# Altium project imbuelight_stair_controler_ver_1.0.PrjPcb
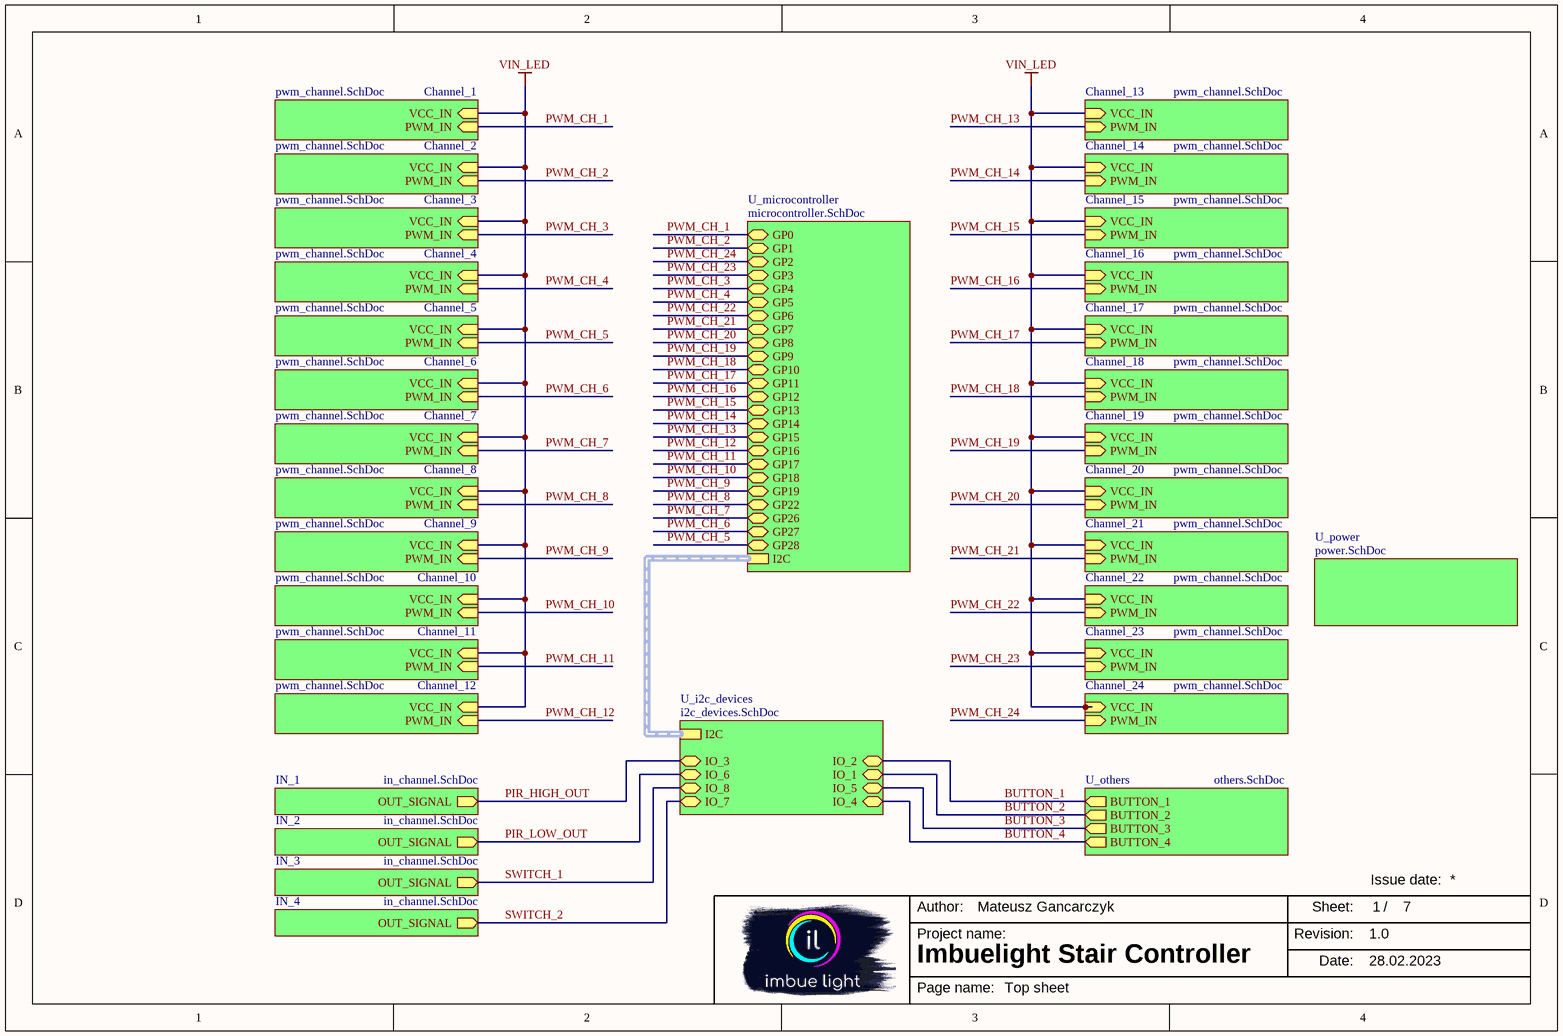
[diagram p0: Top.SchDoc]
My_Author: Mateusz Gancarczyk; My_Date: 28.02.2023; My_NameOfProject: Imbuelight Stair Controller; My_Revision: 1.0
7 sheets, 277 parts. Net scope: hierarchical (ports join the sheet entries above them; power ports are global).
Board file: imbuelight_stair_controller.PcbDoc
Sheets:
  Top.SchDoc
    Channel_1 = pwm_channel.SchDoc
    Channel_2 = pwm_channel.SchDoc
    Channel_3 = pwm_channel.SchDoc
    Channel_4 = pwm_channel.SchDoc
    Channel_5 = pwm_channel.SchDoc
    Channel_6 = pwm_channel.SchDoc
    Channel_7 = pwm_channel.SchDoc
    Channel_8 = pwm_channel.SchDoc
    Channel_9 = pwm_channel.SchDoc
    Channel_10 = pwm_channel.SchDoc
    Channel_11 = pwm_channel.SchDoc
    Channel_12 = pwm_channel.SchDoc
    Channel_13 = pwm_channel.SchDoc
    Channel_14 = pwm_channel.SchDoc
    Channel_15 = pwm_channel.SchDoc
    Channel_16 = pwm_channel.SchDoc
    Channel_17 = pwm_channel.SchDoc
    Channel_18 = pwm_channel.SchDoc
    Channel_19 = pwm_channel.SchDoc
    Channel_20 = pwm_channel.SchDoc
    Channel_21 = pwm_channel.SchDoc
    Channel_22 = pwm_channel.SchDoc
    Channel_23 = pwm_channel.SchDoc
    Channel_24 = pwm_channel.SchDoc
    IN_1 = in_channel.SchDoc
    IN_2 = in_channel.SchDoc
    IN_3 = in_channel.SchDoc
    IN_4 = in_channel.SchDoc
    U_microcontroller = microcontroller.SchDoc
    U_i2c_devices = i2c_devices.SchDoc
    U_power = power.SchDoc
    U_others = others.SchDoc

## Sheet Top.SchDoc
size A4; SheetNumber: 1; SheetTotal: 7; NameOfSheet: Top sheet

### Sub-sheets
Channel_1 = pwm_channel.SchDoc: VCC_IN (in), PWM_IN (in)
Channel_2 = pwm_channel.SchDoc: VCC_IN (in), PWM_IN (in)
Channel_3 = pwm_channel.SchDoc: VCC_IN (in), PWM_IN (in)
Channel_4 = pwm_channel.SchDoc: VCC_IN (in), PWM_IN (in)
Channel_5 = pwm_channel.SchDoc: VCC_IN (in), PWM_IN (in)
Channel_6 = pwm_channel.SchDoc: VCC_IN (in), PWM_IN (in)
Channel_7 = pwm_channel.SchDoc: VCC_IN (in), PWM_IN (in)
Channel_8 = pwm_channel.SchDoc: VCC_IN (in), PWM_IN (in)
Channel_9 = pwm_channel.SchDoc: VCC_IN (in), PWM_IN (in)
Channel_10 = pwm_channel.SchDoc: VCC_IN (in), PWM_IN (in)
Channel_11 = pwm_channel.SchDoc: VCC_IN (in), PWM_IN (in)
Channel_12 = pwm_channel.SchDoc: VCC_IN (in), PWM_IN (in)
Channel_13 = pwm_channel.SchDoc: VCC_IN (in), PWM_IN (in)
Channel_14 = pwm_channel.SchDoc: VCC_IN (in), PWM_IN (in)
Channel_15 = pwm_channel.SchDoc: VCC_IN (in), PWM_IN (in)
Channel_16 = pwm_channel.SchDoc: VCC_IN (in), PWM_IN (in)
Channel_17 = pwm_channel.SchDoc: VCC_IN (in), PWM_IN (in)
Channel_18 = pwm_channel.SchDoc: VCC_IN (in), PWM_IN (in)
Channel_19 = pwm_channel.SchDoc: VCC_IN (in), PWM_IN (in)
Channel_20 = pwm_channel.SchDoc: VCC_IN (in), PWM_IN (in)
Channel_21 = pwm_channel.SchDoc: VCC_IN (in), PWM_IN (in)
Channel_22 = pwm_channel.SchDoc: VCC_IN (in), PWM_IN (in)
Channel_23 = pwm_channel.SchDoc: VCC_IN (in), PWM_IN (in)
Channel_24 = pwm_channel.SchDoc: VCC_IN (in), PWM_IN (in)
IN_1 = in_channel.SchDoc: OUT_SIGNAL (out)
IN_2 = in_channel.SchDoc: OUT_SIGNAL (out)
IN_3 = in_channel.SchDoc: OUT_SIGNAL (out)
IN_4 = in_channel.SchDoc: OUT_SIGNAL (out)
U_i2c_devices = i2c_devices.SchDoc: I2C (harness I2C_SYS2), IO_1 (bidir), IO_2 (bidir), IO_3 (bidir), IO_4 (bidir), IO_5 (bidir), IO_6 (bidir), IO_7 (bidir), IO_8 (bidir)
U_microcontroller = microcontroller.SchDoc: GP0 (bidir), GP1 (bidir), GP2 (bidir), GP3 (bidir), GP4 (bidir), GP5 (bidir), GP6 (bidir), GP7 (bidir), GP8 (bidir), GP9 (bidir), GP10 (bidir), GP11 (bidir), GP12 (bidir), GP13 (bidir), GP14 (bidir), GP15 (bidir), GP16 (bidir), GP17 (bidir), GP18 (bidir), GP19 (bidir), GP22 (bidir), GP26 (bidir), GP27 (bidir), GP28 (bidir), I2C (harness I2C_SYS2)
U_others = others.SchDoc: BUTTON_1 (out), BUTTON_2 (out), BUTTON_3 (out), BUTTON_4 (out)
U_power = power.SchDoc: no entries

### Nets
VIN_LED: sheet Channel_1/VCC_IN, sheet Channel_2/VCC_IN, sheet Channel_3/VCC_IN, sheet Channel_4/VCC_IN, sheet Channel_5/VCC_IN, sheet Channel_6/VCC_IN, sheet Channel_7/VCC_IN, sheet Channel_8/VCC_IN, sheet Channel_9/VCC_IN, sheet Channel_10/VCC_IN, sheet Channel_11/VCC_IN, sheet Channel_12/VCC_IN, sheet Channel_13/VCC_IN, sheet Channel_14/VCC_IN, sheet Channel_15/VCC_IN, sheet Channel_16/VCC_IN, sheet Channel_17/VCC_IN, sheet Channel_18/VCC_IN, sheet Channel_19/VCC_IN, sheet Channel_20/VCC_IN, sheet Channel_21/VCC_IN, sheet Channel_22/VCC_IN, sheet Channel_23/VCC_IN, sheet Channel_24/VCC_IN
BUTTON_1: sheet U_i2c_devices/IO_2, sheet U_others/BUTTON_1
BUTTON_2: sheet U_i2c_devices/IO_1, sheet U_others/BUTTON_2
BUTTON_3: sheet U_i2c_devices/IO_5, sheet U_others/BUTTON_3
BUTTON_4: sheet U_i2c_devices/IO_4, sheet U_others/BUTTON_4
PIR_HIGH_OUT: sheet IN_1/OUT_SIGNAL, sheet U_i2c_devices/IO_3
PIR_LOW_OUT: sheet IN_2/OUT_SIGNAL, sheet U_i2c_devices/IO_6
PWM_CH_1: sheet Channel_1/PWM_IN, sheet U_microcontroller/GP0  [project net GP0]
PWM_CH_2: sheet Channel_2/PWM_IN, sheet U_microcontroller/GP1  [project net GP1]
PWM_CH_3: sheet Channel_3/PWM_IN, sheet U_microcontroller/GP4  [project net GP4]
PWM_CH_4: sheet Channel_4/PWM_IN, sheet U_microcontroller/GP5  [project net GP5]
PWM_CH_5: sheet Channel_5/PWM_IN, sheet U_microcontroller/GP28  [project net GP28]
PWM_CH_6: sheet Channel_6/PWM_IN, sheet U_microcontroller/GP27  [project net GP27]
PWM_CH_7: sheet Channel_7/PWM_IN, sheet U_microcontroller/GP26  [project net GP26]
PWM_CH_8: sheet Channel_8/PWM_IN, sheet U_microcontroller/GP22  [project net GP22]
PWM_CH_9: sheet Channel_9/PWM_IN, sheet U_microcontroller/GP19  [project net GP19]
PWM_CH_10: sheet Channel_10/PWM_IN, sheet U_microcontroller/GP18  [project net GP18]
PWM_CH_11: sheet Channel_11/PWM_IN, sheet U_microcontroller/GP17  [project net GP17]
PWM_CH_12: sheet Channel_12/PWM_IN, sheet U_microcontroller/GP16  [project net GP16]
PWM_CH_13: sheet Channel_13/PWM_IN, sheet U_microcontroller/GP15  [project net GP15]
PWM_CH_14: sheet Channel_14/PWM_IN, sheet U_microcontroller/GP14  [project net GP14]
PWM_CH_15: sheet Channel_15/PWM_IN, sheet U_microcontroller/GP13  [project net GP13]
PWM_CH_16: sheet Channel_16/PWM_IN, sheet U_microcontroller/GP12  [project net GP12]
PWM_CH_17: sheet Channel_17/PWM_IN, sheet U_microcontroller/GP11  [project net GP11]
PWM_CH_18: sheet Channel_18/PWM_IN, sheet U_microcontroller/GP10  [project net GP10]
PWM_CH_19: sheet Channel_19/PWM_IN, sheet U_microcontroller/GP9  [project net GP9]
PWM_CH_20: sheet Channel_20/PWM_IN, sheet U_microcontroller/GP8  [project net GP8]
PWM_CH_21: sheet Channel_21/PWM_IN, sheet U_microcontroller/GP7  [project net GP7]
PWM_CH_22: sheet Channel_22/PWM_IN, sheet U_microcontroller/GP6  [project net GP6]
PWM_CH_23: sheet Channel_23/PWM_IN, sheet U_microcontroller/GP3  [project net GP3]
PWM_CH_24: sheet Channel_24/PWM_IN, sheet U_microcontroller/GP2  [project net GP2]
SWITCH_1: sheet IN_3/OUT_SIGNAL, sheet U_i2c_devices/IO_8
SWITCH_2: sheet IN_4/OUT_SIGNAL, sheet U_i2c_devices/IO_7

### Buses and harness runs
harness sheet U_i2c_devices/I2C = sheet U_microcontroller/I2C

### Notes on the sheet
- Author:
- Sheet:
- /
- Issue date:
- Project name:
- Revision:
- Date:
- Page name:

## Sheet pwm_channel.SchDoc
size A4; SheetNumber: 2; SheetTotal: 7; NameOfSheet: PWM channels
Used 24 times, as channels Channel_1, Channel_2, Channel_3, Channel_4, Channel_5, Channel_6, Channel_7, Channel_8, Channel_9, Channel_10, Channel_11, Channel_12, Channel_13, Channel_14, Channel_15, Channel_16, Channel_17, Channel_18, Channel_19, Channel_20, Channel_21, Channel_22, Channel_23, Channel_24. Parts and nets are listed once, with the designators drawn on the sheet.
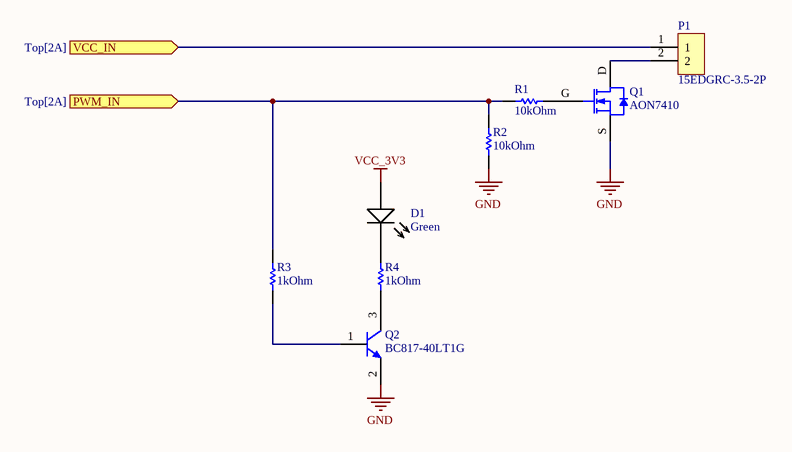
[diagram p1: pwm_channel.SchDoc]

### Parts
D1  Colour: Green  [LED_0603]  (hidden comment: C205450)
P1  15EDGRC-3.5-2P  [15EDGRC-3.5 - 2 pin]
Q1  AON7410  [DFN3x3_8L]
Q2  BC817-40LT1G  [SOT-23A]
R1  Resistance: 10kOhm  [RES_0603]  (hidden comment: 0603 10kOhm 1%)
R2  Resistance: 10kOhm  [RES_0603]  (hidden comment: 0603 10kOhm 1%)
R3  Resistance: 1kOhm  [RES_0603]  (hidden comment: 0603 1kOhm 1%)
R4  Resistance: 1kOhm  [RES_0603]  (hidden comment: 0603 1kOhm 1%)

### Ports
PWM_IN (in, see Top[2A]), VCC_IN (in, see Top[2A])

### Nets
GND: Q1.S Q2.2(E) R2.2
VCC_3V3: D1.A
PWM_IN: R1.2 R2.1 R3.2 ; port PWM_IN
VCC_IN: P1.1 ; port VCC_IN
NetD1_C: D1.C R4.2
NetP1_2: P1.2 Q1.D
NetQ1_G: Q1.G R1.1
NetQ2_1: Q2.1 R3.1
NetQ2_3: Q2.3(C) R4.1

### Channels
Channel_1: designators end in _Channel_1; ports PWM_IN=GP0 VCC_IN=VIN_LED
Channel_2: designators end in _Channel_2; ports PWM_IN=GP1 VCC_IN=VIN_LED
Channel_3: designators end in _Channel_3; ports PWM_IN=GP4 VCC_IN=VIN_LED
Channel_4: designators end in _Channel_4; ports PWM_IN=GP5 VCC_IN=VIN_LED
Channel_5: designators end in _Channel_5; ports PWM_IN=GP28 VCC_IN=VIN_LED
Channel_6: designators end in _Channel_6; ports PWM_IN=GP27 VCC_IN=VIN_LED
Channel_7: designators end in _Channel_7; ports PWM_IN=GP26 VCC_IN=VIN_LED
Channel_8: designators end in _Channel_8; ports PWM_IN=GP22 VCC_IN=VIN_LED
Channel_9: designators end in _Channel_9; ports PWM_IN=GP19 VCC_IN=VIN_LED
Channel_10: designators end in _Channel_10; ports PWM_IN=GP18 VCC_IN=VIN_LED
Channel_11: designators end in _Channel_11; ports PWM_IN=GP17 VCC_IN=VIN_LED
Channel_12: designators end in _Channel_12; ports PWM_IN=GP16 VCC_IN=VIN_LED
Channel_13: designators end in _Channel_13; ports PWM_IN=GP15 VCC_IN=VIN_LED
Channel_14: designators end in _Channel_14; ports PWM_IN=GP14 VCC_IN=VIN_LED
Channel_15: designators end in _Channel_15; ports PWM_IN=GP13 VCC_IN=VIN_LED
Channel_16: designators end in _Channel_16; ports PWM_IN=GP12 VCC_IN=VIN_LED
Channel_17: designators end in _Channel_17; ports PWM_IN=GP11 VCC_IN=VIN_LED
Channel_18: designators end in _Channel_18; ports PWM_IN=GP10 VCC_IN=VIN_LED
Channel_19: designators end in _Channel_19; ports PWM_IN=GP9 VCC_IN=VIN_LED
Channel_20: designators end in _Channel_20; ports PWM_IN=GP8 VCC_IN=VIN_LED
Channel_21: designators end in _Channel_21; ports PWM_IN=GP7 VCC_IN=VIN_LED
Channel_22: designators end in _Channel_22; ports PWM_IN=GP6 VCC_IN=VIN_LED
Channel_23: designators end in _Channel_23; ports PWM_IN=GP3 VCC_IN=VIN_LED
Channel_24: designators end in _Channel_24; ports PWM_IN=GP2 VCC_IN=VIN_LED

### Notes on the sheet
- Author:
- Sheet:
- /
- Issue date:
- Project name:
- Revision:
- Date:
- Page name:

### Library data of the parts
D1 = LED diode: Generic LED diode SMD Green; Forward current: 0mA; Forward Voltage: 0V; Manufacturer Part Number: C205450; Supplier 1: LCSC; Supplier Part Number 1: C205450
P1 = 15EDGRC-3.5-2P: 15EDGRC-3.5 - 2 pin; Manufacturer Part Number: 15EDGRC-3.5-2P; Supplier 1: LCSC; Supplier Part Number 1: C61791
Q1 = AON7410: Tranzystor MOSFET kanał N; Supplier 1: LCSC; Supplier Part Number 1: C269266
Q2 = BC817-40LT1G: General Purpose Transistor, NPN Silicon, 3-Pin SOT-23, Pb-Free, Tape and Reel; Manufacturer: On Semiconductor; fT Min (MHz): 100; IC Continuous (A): 0.5; ComponentLink2URL: http://www.onsemi.com/pub_link/Collateral/BC817-16LT1-D.PDF; DatasheetVersion: Rev. 12; ComponentLink3URL: http://www.onsemi.cn/pub_link/Collateral/318-08.PDF; ComponentLink3Description: Package Specification; ComponentLink1Description: Manufacturer URL; Mounting Technology: Surface Mount; ComponentLink1URL: http://www.onsemi.com/; Packing: Tape and Reel; ComponentLink2Description: Datasheet; Polarity: NPN; RoHS: TRUE; PackageVersion: Rev. AP, 11/2009; PartNumber: BC817-40LT1G; PackageDescription: 3-Pin Small Outline Transistor, Body 2.92 x 1.3 mm, Pitch 0.95 mm; PackageReference: SOT-23-3-318-08; Supplier 1: LCSC; Supplier Part Number 1: C94412
R1-R4 = Resistor SMD_1: Generic Resistor SMD; Supplier 1: LCSC
  R1 R2: Manufacturer Part Number: 0603 10kOhm 1%; Supplier Part Number 1: C3017715
  R3 R4: Manufacturer Part Number: 0603 1kOhm 1%; Supplier Part Number 1: C3016283

## Sheet in_channel.SchDoc
size A4; SheetNumber: 7; SheetTotal: 7; NameOfSheet: PWM channels
Used 4 times, as channels IN_1, IN_2, IN_3, IN_4. Parts and nets are listed once, with the designators drawn on the sheet.
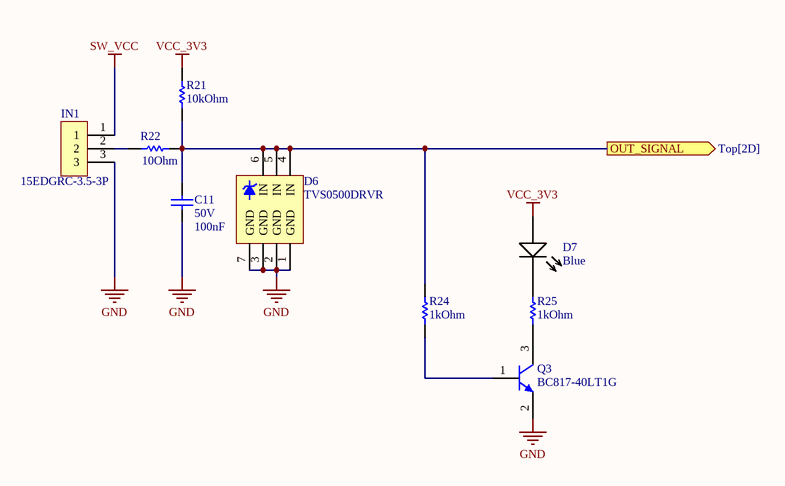
[diagram p2: in_channel.SchDoc]

### Parts
C11  Voltage: 50V  Capacitance: 100nF  [CAP_0603_High_density]
D6  TVS0500DRVR  [FP-DRV0006A-IPC_C]
D7  Colour: Blue  [LED_0603]  (hidden comment: C84266)
IN1  15EDGRC-3.5-3P  [15EDGRC-3.5 - 3 PIN]
Q3  BC817-40LT1G  [SOT-23A]
R21  Resistance: 10kOhm  [RES_0603]  (hidden comment: 0603 10kOhm 1%)
R22  Resistance: 10Ohm  [RES_0603]  (hidden comment: 0603 10Ohm 1%)
R24  Resistance: 1kOhm  [RES_0603]  (hidden comment: 0603 1kOhm 1%)
R25  Resistance: 1kOhm  [RES_0603]  (hidden comment: 0603 1kOhm 1%)

### Ports
OUT_SIGNAL (out, see Top[2D])

### Nets
GND: C11.2 D6.1(GND) D6.2(GND) D6.3(GND) D6.7(GND) IN1.3 Q3.2(E)
SW_VCC: IN1.1
VCC_3V3: D7.A R21.1
OUT_SIGNAL: C11.1 D6.4(IN) D6.5(IN) D6.6(IN) R21.2 R22.2 R24.2 ; port OUT_SIGNAL
NetD7_C: D7.C R25.2
NetIN1_2: IN1.2 R22.1
NetQ3_1: Q3.1 R24.1
NetQ3_3: Q3.3(C) R25.1

### Channels
IN_1: designators end in _IN_1; ports OUT_SIGNAL=PIR_HIGH_OUT
IN_2: designators end in _IN_2; ports OUT_SIGNAL=PIR_LOW_OUT
IN_3: designators end in _IN_3; ports OUT_SIGNAL=SWITCH_1
IN_4: designators end in _IN_4; ports OUT_SIGNAL=SWITCH_2

### Notes on the sheet
- Author:
- Sheet:
- /
- Issue date:
- Project name:
- Revision:
- Date:
- Page name:

### Library data of the parts
C11 = Capacitor SMD: Generic Ceramic Capacitor SMD; Temperature Coefficient: X7R; Tolerance: 10%; Package: 0603; Supplier 1: LCSC; Supplier Part Number 1: C282519
D6 = TVS0500DRVR: ESD Suppressors / TVS Diodes 5V flat-clamp surge protection device 6-WSON -40 to 125; Supplier 1: Digi-Key; Supplier Part Number 1: 296-48382-1-ND
D7 = LED diode: Generic LED diode SMD Blue; Forward current: 0mA; Forward Voltage: 0V; Manufacturer Part Number: C84266; Supplier 1: LCSC; Supplier Part Number 1: C84266
IN1 = 15EDGRC-3.5-3P: 15EDGRC-3.5 - 3 pin; Manufacturer Part Number: 15EDGRC-3.5-3P; Supplier 1: LCSC; Supplier Part Number 1: C880573
Q3 = BC817-40LT1G: as Q2 on sheet pwm_channel; ComponentLink2URL: http://www.onsemi.com/pub_link/Collateral/BC817-16LT1-D.PDF; DatasheetVersion: Rev. 12; ComponentLink3URL: http://www.onsemi.cn/pub_link/Collateral/318-08.PDF; ComponentLink3Description: Package Specification; ComponentLink1Description: Manufacturer URL; Mounting Technology: Surface Mount; ComponentLink1URL: http://www.onsemi.com/; Packing: Tape and Reel; ComponentLink2Description: Datasheet; Polarity: NPN; RoHS: TRUE; PackageVersion: Rev. AP, 11/2009; PartNumber: BC817-40LT1G; PackageDescription: 3-Pin Small Outline Transistor, Body 2.92 x 1.3 mm, Pitch 0.95 mm; PackageReference: SOT-23-3-318-08; Supplier 1: LCSC; Supplier Part Number 1: C94412
R21 R22 R24 R25 = Resistor SMD_1: Generic Resistor SMD; Supplier 1: LCSC
  R21: Manufacturer Part Number: 0603 10kOhm 1%; Supplier Part Number 1: C3017715
  R22: Manufacturer Part Number: 0603 10Ohm 1%; Supplier Part Number 1: C22859
  R24 R25: Manufacturer Part Number: 0603 1kOhm 1%; Supplier Part Number 1: C3016283

## Sheet microcontroller.SchDoc
size A4; SheetNumber: 3; SheetTotal: 7; NameOfSheet: Microcontroller
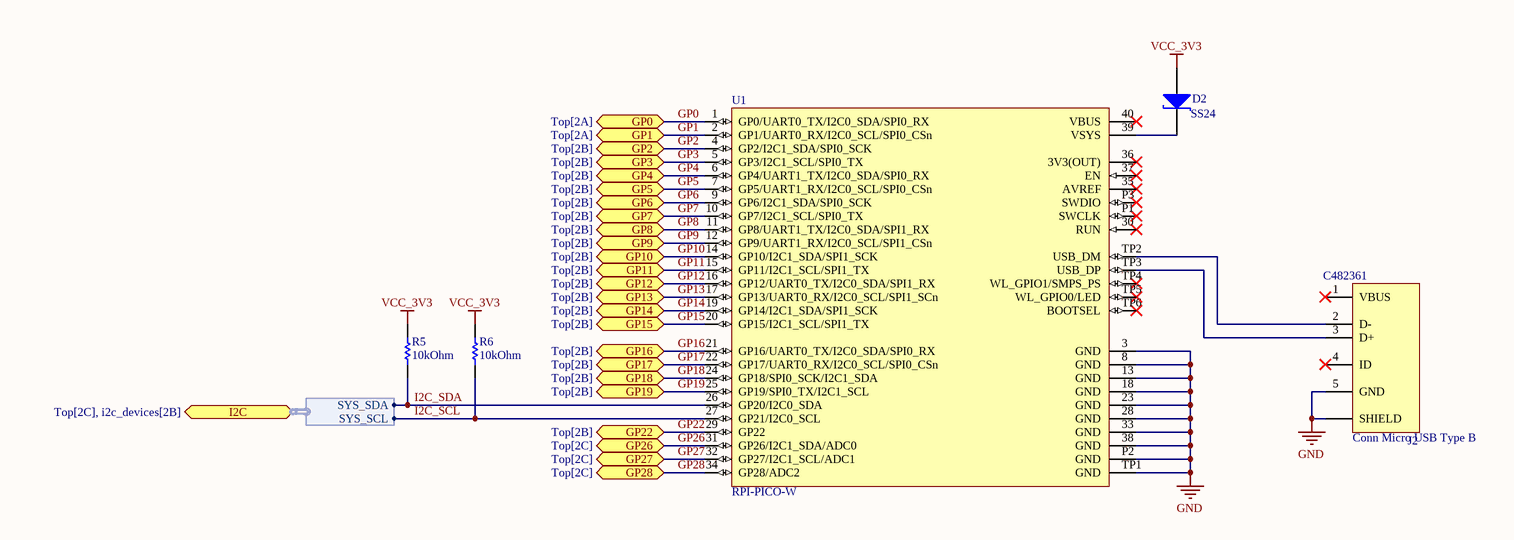
[diagram p3: microcontroller.SchDoc]

### Parts
D2  SS24  [DO214AA]
J2  Name: Conn Micro USB Type B  Supplier Part Number 1: C482361  [10118193-0001LF]  (hidden comment: 10118193-0001LF)
R5  Resistance: 10kOhm  [RES_0603]  (hidden comment: 0603 10kOhm 1%)
R6  Resistance: 10kOhm  [RES_0603]  (hidden comment: 0603 10kOhm 1%)
U1  RPI-PICO-W  [RPI-PICO-W]

### Ports
GP0 (bidir, see Top[2A]), GP1 (bidir, see Top[2A]), GP2 (bidir, see Top[2B]), GP3 (bidir, see Top[2B]), GP4 (bidir, see Top[2B]), GP5 (bidir, see Top[2B]), GP6 (bidir, see Top[2B]), GP7 (bidir, see Top[2B]), GP8 (bidir, see Top[2B]), GP9 (bidir, see Top[2B]), GP10 (bidir, see Top[2B]), GP11 (bidir, see Top[2B]), GP12 (bidir, see Top[2B]), GP13 (bidir, see Top[2B]), GP14 (bidir, see Top[2B]), GP15 (bidir, see Top[2B]), GP16 (bidir, see Top[2B]), GP17 (bidir, see Top[2B]), GP18 (bidir, see Top[2B]), GP19 (bidir, see Top[2B]), GP22 (bidir, see Top[2B]), GP26 (bidir, see Top[2C]), GP27 (bidir, see Top[2C]), GP28 (bidir, see Top[2C]), I2C (bidir, harness I2C_SYS2, see Top[2C], i2c_devices[2B])

### Harnesses
I2C_SYS2: SYS_SCL, SYS_SDA

### Nets
GND: J2.5(GND) J2.S1(SHIELD) U1.3(GND) U1.8(GND) U1.13(GND) U1.18(GND) U1.23(GND) U1.28(GND) U1.33(GND) U1.38(GND) U1.P2(GND) U1.TP1(GND)
VCC_3V3: D2.A R5.1 R6.1
GP0: U1.1(GP0/UART0_TX/I2C0_SDA/SPI0_RX) ; port GP0
GP1: U1.2(GP1/UART0_RX/I2C0_SCL/SPI0_CSn) ; port GP1
GP2: U1.4(GP2/I2C1_SDA/SPI0_SCK) ; port GP2
GP3: U1.5(GP3/I2C1_SCL/SPI0_TX) ; port GP3
GP4: U1.6(GP4/UART1_TX/I2C0_SDA/SPI0_RX) ; port GP4
GP5: U1.7(GP5/UART1_RX/I2C0_SCL/SPI0_CSn) ; port GP5
GP6: U1.9(GP6/I2C1_SDA/SPI0_SCK) ; port GP6
GP7: U1.10(GP7/I2C1_SCL/SPI0_TX) ; port GP7
GP8: U1.11(GP8/UART1_TX/I2C0_SDA/SPI1_RX) ; port GP8
GP9: U1.12(GP9/UART1_RX/I2C0_SCL/SPI1_CSn) ; port GP9
GP10: U1.14(GP10/I2C1_SDA/SPI1_SCK) ; port GP10
GP11: U1.15(GP11/I2C1_SCL/SPI1_TX) ; port GP11
GP12: U1.16(GP12/UART0_TX/I2C0_SDA/SPI1_RX) ; port GP12
GP13: U1.17(GP13/UART0_RX/I2C0_SCL/SPI1_SCn) ; port GP13
GP14: U1.19(GP14/I2C1_SDA/SPI1_SCK) ; port GP14
GP15: U1.20(GP15/I2C1_SCL/SPI1_TX) ; port GP15
GP16: U1.21(GP16/UART0_TX/I2C0_SDA/SPI0_RX) ; port GP16
GP17: U1.22(GP17/UART0_RX/I2C0_SCL/SPI0_CSn) ; port GP17
GP18: U1.24(GP18/SPI0_SCK/I2C1_SDA) ; port GP18
GP19: U1.25(GP19/SPI0_TX/I2C1_SCL) ; port GP19
GP22: U1.29(GP22) ; port GP22
GP26: U1.31(GP26/I2C1_SDA/ADC0) ; port GP26
GP27: U1.32(GP27/I2C1_SCL/ADC1) ; port GP27
GP28: U1.34(GP28/ADC2) ; port GP28
I2C_SCL: R6.2 U1.27(GP21/I2C0_SCL) ; port I2C.SYS_SCL
I2C_SDA: R5.2 U1.26(GP20/I2C0_SDA) ; port I2C.SYS_SDA
NetD2_K: D2.K U1.39(VSYS)
NetJ2_2: J2.2(D-) U1.TP2(USB_DM)
NetJ2_3: J2.3(D+) U1.TP3(USB_DP)

Not connected (* = marked no-connect by the designer): J2 1(VBUS)* 4(ID)*; U1 30(RUN)* 35(AVREF)* 36(3V3(OUT))* 37(EN)* 40(VBUS)* P1(SWCLK)* P3(SWDIO)* TP4(WL_GPIO1/SMPS_PS)* TP5(WL_GPIO0/LED)* TP6(BOOTSEL)*

### Notes on the sheet
- Author:
- Sheet:
- /
- Issue date:
- Project name:
- Revision:
- Date:
- Page name:

### Library data of the parts
D2 = Dioda prostownicza Schottky: 40V Single 500mV@2A 2A DO-214AA Schottky Barrier Diodes (SBD) ROHS; Typ obudowy: SMA; Opis: Dioda prostownicza Schottky; Wartość: SS24; Supplier 1: LCSC; Supplier Part Number 1: C2845097
J2 = 10118193-0001LF: Conn Micro USB Type B RCP 5 POS 0.65mm Solder RA SMD 5 Terminal 1 Port T/R; Supplier 1: LCSC
R5 R6 = Resistor SMD_1: Generic Resistor SMD; Manufacturer Part Number: 0603 10kOhm 1%; Supplier 1: LCSC; Supplier Part Number 1: C3017715
U1 = RPI-PICO-W: Raspberry Pi Pico W - RP2040 ARM Cortex M0+ CYW43439; Manufacturer: Raspberry Pi Foundation; Manufacturer Part No: SC0915; Mounting Technology: SMT; Supplier: DigiKey; Supplier Part No: 2648-SC0915CT-ND; Supplier Link: https://www.digikey.com/en/products/detail/raspberry-pi/SC0915/13684020

## Sheet i2c_devices.SchDoc
size A4; SheetNumber: 4; SheetTotal: 7; NameOfSheet: OLED display
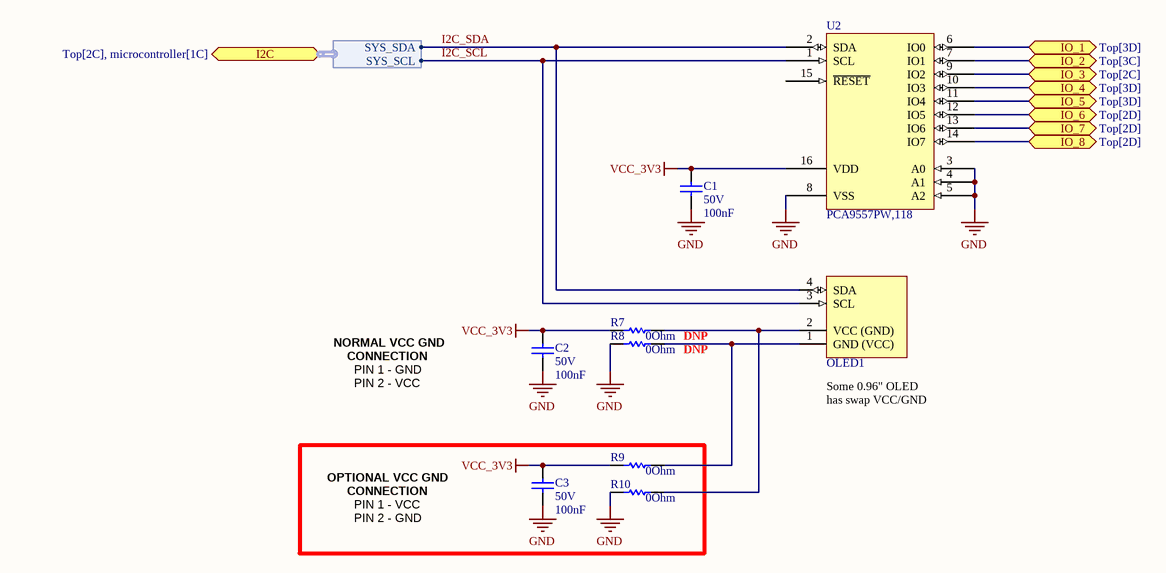
[diagram p4: i2c_devices.SchDoc]

### Parts
C1  Voltage: 50V  Capacitance: 100nF  [CAP_0603_High_density]
C2  Voltage: 50V  Capacitance: 100nF  [CAP_0603_High_density]
C3  Voltage: 50V  Capacitance: 100nF  [CAP_0603_High_density]
OLED1  MDOB128064WV-YBI  [OLED_I2C]  (value not drawn)
R7  Resistance: 0Ohm  [RES_0603]  (hidden comment: RES_0_0402_1_1/16)  (no BOM)
R8  Resistance: 0Ohm  [RES_0603]  (hidden comment: RES_0_0402_1_1/16)  (no BOM)
R9  Resistance: 0Ohm  [RES_0603]  (hidden comment: RES_0_0402_1_1/16)
R10  Resistance: 0Ohm  [RES_0603]  (hidden comment: RES_0_0402_1_1/16)
U2  PCA9557PW,118  [TSOP65P640X120-16M]

### Ports
I2C (bidir, harness I2C_SYS2, see Top[2C], microcontroller[1C]), IO_1 (bidir, see Top[3D]), IO_2 (bidir, see Top[3C]), IO_3 (bidir, see Top[2C]), IO_4 (bidir, see Top[3D]), IO_5 (bidir, see Top[3D]), IO_6 (bidir, see Top[2D]), IO_7 (bidir, see Top[2D]), IO_8 (bidir, see Top[2D])

### Harnesses
I2C_SYS2: SYS_SCL, SYS_SDA

### Nets
GND: C1.2 C2.2 C3.2 R8.2 R10.2 U2.3(A0) U2.4(A1) U2.5(A2) U2.8(VSS)
VCC_3V3: C1.1 C2.1 C3.1 R7.2 R9.2 U2.16(VDD)
BUTTON_1: U2.7(IO1) ; port IO_2
BUTTON_2: U2.6(IO0) ; port IO_1
BUTTON_3: U2.11(IO4) ; port IO_5
BUTTON_4: U2.10(IO3) ; port IO_4
I2C_SCL: OLED1.3(SCL) U2.1(SCL) ; port I2C.SYS_SCL
I2C_SDA: OLED1.4(SDA) U2.2(SDA) ; port I2C.SYS_SDA
PIR_HIGH_OUT: U2.9(IO2) ; port IO_3
PIR_LOW_OUT: U2.12(IO5) ; port IO_6
SWITCH_1: U2.14(IO7) ; port IO_8
SWITCH_2: U2.13(IO6) ; port IO_7
NetOLED1_1: OLED1.1(GND_(VCC)) R8.1 R9.1
NetOLED1_2: OLED1.2(VCC_(GND)) R7.1 R10.1

Not connected (* = marked no-connect by the designer): U2 15(~{RESET})

### Notes on the sheet
- NORMAL VCC GND
- CONNECTION
- DNP
- PIN 1 - GND
- PIN 2 - VCC
- (near OLED1) Some 0.96" OLED has swap VCC/GND
- OPTIONAL VCC GND
- PIN 1 - VCC
- PIN 2 - GND
- Author:
- Sheet:
- /
- Issue date:
- Project name:
- Revision:
- Date:
- Page name:

### Library data of the parts
C1-C3 = Capacitor SMD: as C11 on sheet in_channel; Package: 0603; Supplier 1: LCSC; Supplier Part Number 1: C282519
OLED1 = OLED_I2C: Graphic OLED, 128 x 64 Pixels, Yellow on Black, 3.3V, I2C, 27.30mm x 27.30mm x 2.72mm panel size; Supplier 1: Farnell; Supplier Part Number 1: 3565084; ClassName: DISPLAYS
R7-R10 = Resistor SMD: Generic Resistor SMD; Manufacturer Part Number: RES_0_0402_1_1/16; Supplier 1: LCSC; Supplier Part Number 1: C21189
U2 = PCA9557PW,118: 8-bit I2C-bus and SMBus I/O port with reset; Supplier 1: LCSC; Supplier Part Number 1: C141380

## Sheet power.SchDoc
size A4; SheetNumber: 5; SheetTotal: 7; NameOfSheet: Power
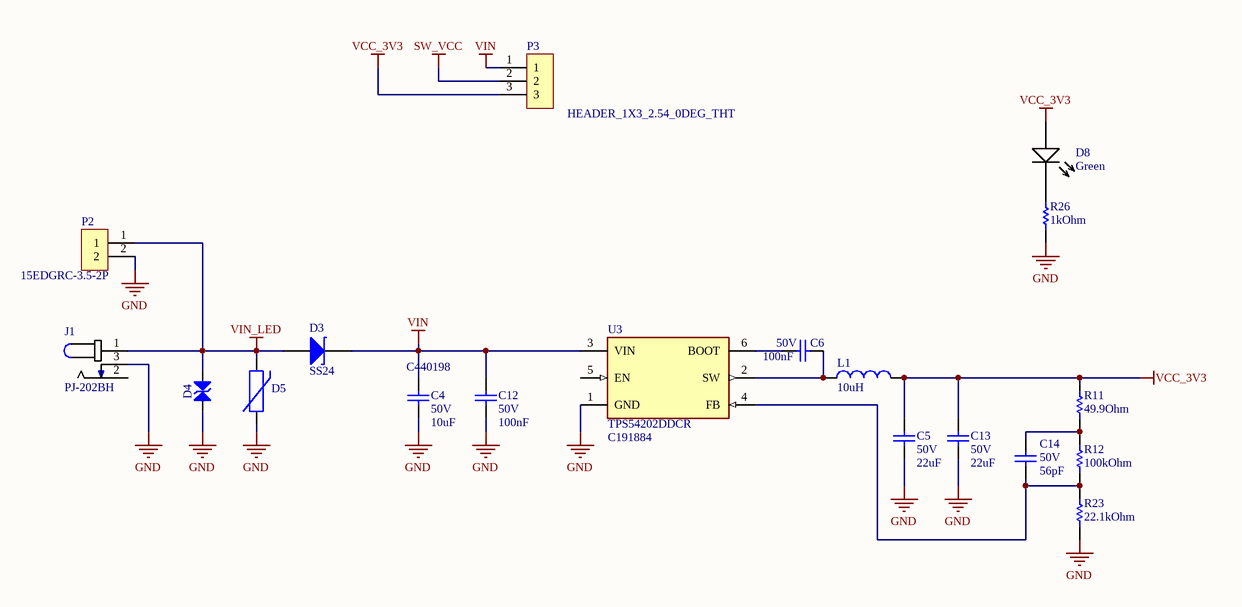
[diagram p5: power.SchDoc]

### Parts
C4  Voltage: 50V  Capacitance: 10uF  Supplier Part Number 1: C440198  [CAP_0805_High_density]  (hidden comment: 10uF 0805 50V)
C5  Voltage: 50V  Capacitance: 22uF  [CAP_0805_High_density]  (hidden comment: 22uF 0805 50V)
C6  Voltage: 50V  Capacitance: 100nF  [CAP_0603_High_density]
C12  Voltage: 50V  Capacitance: 100nF  [CAP_0603_High_density]
C13  Voltage: 50V  Capacitance: 22uF  [CAP_0805_High_density]  (hidden comment: 22uF 0805 50V)
C14  Voltage: 50V  Capacitance: 56pF  [CAP_0603_High_density]  (hidden comment: 56pF 0603 50V)
D3  SS24  [DO214AA]
D4  SMCJ15CA  [DIOM7959X262N]  (value not drawn)
D5  C283933  [SIOV-S14K50]  (value not drawn)
D8  Colour: Green  [LED_0603]  (hidden comment: C205450)
J1  PJ-202BH  [CUI_PJ-202BH]
L1  Inductance: 10uH  [INDP8080X42N]  (hidden comment: NR8040T100M)
P2  15EDGRC-3.5-2P  [15EDGRC-3.5 - 2 pin]
P3  HEADER_1X3_2.54_0DEG_THT  [HDR1X3_2.54]
R11  Resistance: 49.9Ohm  [RES_0603]  (hidden comment: 0603 49.9Ohm 1%)
R12  Resistance: 100kOhm  [RES_0603]  (hidden comment: 0603 100kOhm 1%)
R23  Resistance: 22.1kOhm  [RES_0603]  (hidden comment: 0603 22.1kOhm 1%)
R26  Resistance: 1kOhm  [RES_0603]  (hidden comment: 0603 1kOhm 1%)
U3  TPS54202DDCR  Supplier Part Number 1: C191884  [FP-DDC0006A-MFG]

### Nets
GND: C4.1 C5.1 C12.2 C13.1 D4.2(A) D5.1 J1.3 P2.2 R23.2 R26.1 U3.1(GND)
SW_VCC: P3.2
VCC_3V3: C5.2 C13.2 D8.A L1.2 P3.3 R11.1
VIN: C4.2 C12.1 D3.K P3.1 U3.3(VIN)
VIN_LED: D3.A D4.1(C) D5.2 J1.1 P2.1
NetC6_1: C6.1 U3.6(BOOT)
NetC6_2: C6.2 L1.1 U3.2(SW)
NetC14_1: C14.1 R12.2 R23.1 U3.4(FB)
NetC14_2: C14.2 R11.2 R12.1
NetD8_C: D8.C R26.2

Not connected (* = marked no-connect by the designer): J1 2; U3 5(EN)

### Notes on the sheet
- Author:
- Sheet:
- /
- Issue date:
- Project name:
- Revision:
- Date:
- Page name:

### Library data of the parts
C4 C5 C13 C14 = Capacitor SMD_1: Generic Ceramic Capacitor SMD; Tolerance: 0%; Temperature Coefficient: *; Package: 0805; Supplier 1: LCSC
  C4: Manufacturer Part Number: 10uF 0805 50V
  C5 C13: Manufacturer Part Number: 22uF 0805 50V; Supplier Part Number 1: C98190
  C14: Manufacturer Part Number: 56pF 0603 50V; Supplier Part Number 1: C39148
C6 C12 = Capacitor SMD: as C11 on sheet in_channel; Package: 0603; Supplier 1: LCSC; Supplier Part Number 1: C282519
D3 = Dioda prostownicza Schottky: as D2 on sheet microcontroller; Opis: Dioda prostownicza Schottky; Wartość: SS24; Supplier 1: LCSC; Supplier Part Number 1: C2845097
D4 = SMCJ15CA: 24.4V Clamp 61.5A Ipp Tvs Diode Surface Mount DO-214AB (SMCJ); Part Number: SMCJ28CA; Part Description: Bi-Directional Transient Voltage Suppressor Diode; Manufacturer: LITTELFUSE; Voltage: 28V; Power: 1500W; Table: Diodes; Component Kind: Standard; Component Type: Standard; Device: SMCJ15CA; PackageDescription: DO-214-AB/SMC Molded Diode, Body 7.9x5.9mm, IPC Medium Density; Manufacturer Part Number: SMCJ15CA; Pin Count: 2; Case: DO-214AB; Mounted: Yes; Socket: No; SMD: Yes; ComponentHeight: 2.62mm; HelpURL: \\cern.ch\dfs\Applications\Altium\Datasheets\SMCJ.pdf; Author: CERN DEM JLC; CreateDate: 2009-01-20; LatestRevisionDate: 2010-10-26; Parameter 1: *; Supplier 1: LCSC; Supplier Part Number 1: C720069
D5 = B72214S0500K101: 82V 4.5kA Varistor 1 Circuit Through Hole Disc 14mm; Supplier Part Number 1: C283933; Supplier 1: LCSC; Manufacturer Part Number: C283933
D8 = LED diode: as D1 on sheet pwm_channel; Manufacturer Part Number: C205450; Supplier 1: LCSC; Supplier Part Number 1: C205450
J1 = PJ-202BH: 2.5 x 6.5 mm, 5.0 A, Horizontal, Through Hole, Kinked Pins, Dc Power Jack Connector; MP: PJ-202BH; Supplier Part Number 1: C2851165; Supplier 1: LCSC; Supplier 2: Mouser; Supplier Part Number 2: 490-PJ-202BH; Manufacturer Part Number: PJ-202BH
L1 = NR8040T100M: 10µH Shielded Wirewound Inductor 3.1A 44.2mOhm Max Nonstandard; Supplier 1: LCSC; Supplier Part Number 1: C168127; Rated Current: 3.1A
P2 = 15EDGRC-3.5-2P: 15EDGRC-3.5 - 2 pin; Manufacturer Part Number: 15EDGRC-3.5-2P; Supplier 1: LCSC; Supplier Part Number 1: C61791
P3 = Header 1x3: 3pin 1x3 2.54mm 0.100" pitch header vertical tht; Manufacturer Part Number: HEADER_1X3_2.54_0DEG_THT; Supplier 1: LCSC; Supplier Part Number 1: C5360899
R11 R12 R23 R26 = Resistor SMD_1: Generic Resistor SMD; Supplier 1: LCSC
  R11: Manufacturer Part Number: 0603 49.9Ohm 1%; Supplier Part Number 1: C23185
  R12: Manufacturer Part Number: 0603 100kOhm 1%; Supplier Part Number 1: C25803
  R23: Manufacturer Part Number: 0603 22.1kOhm 1%; Supplier Part Number 1: C137768
  R26: Manufacturer Part Number: 0603 1kOhm 1%; Supplier Part Number 1: C3016283
U3 = TPS54202DDCR: IC REG BUCK ADJ 2A TSOT23-6; Switching Frequency: 500kHz; Quiescent Current: 40uA; Max Output Voltage: 28V; Output Configuration: Positive; Min Output Voltage: 596mV; Min Input Voltage: 4.5V; Synchronous Rectifier: Yes; Output Type: Adjustable; Number of Outputs: 1; Packaging: Tape and Reel; Case/Package: SOT-23-6; RoHS Compliant: Yes; Max Input Voltage: 28V; Max Operating Temperature: 125°C; Min Operating Temperature: -40°C; Output Current: 2A; Lead Free: Lead Free; Mount: Surface Mount; Supplier 1: LCSC

## Sheet others.SchDoc
size A4; SheetNumber: 6; SheetTotal: 7; NameOfSheet: PWM channels
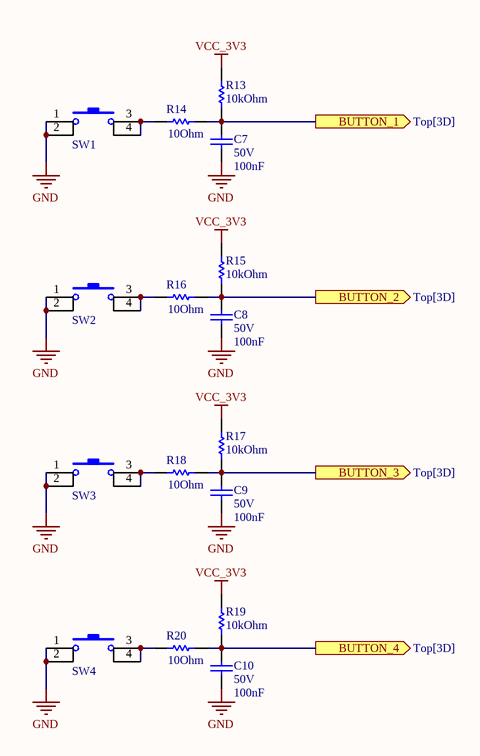
[diagram p6: others.SchDoc]

### Parts
C7  Voltage: 50V  Capacitance: 100nF  [CAP_0603_High_density]
C8  Voltage: 50V  Capacitance: 100nF  [CAP_0603_High_density]
C9  Voltage: 50V  Capacitance: 100nF  [CAP_0603_High_density]
C10  Voltage: 50V  Capacitance: 100nF  [CAP_0603_High_density]
R13  Resistance: 10kOhm  [RES_0603]  (hidden comment: 0603 10kOhm 1%)
R14  Resistance: 10Ohm  [RES_0603]  (hidden comment: 0603 10Ohm 1%)
R15  Resistance: 10kOhm  [RES_0603]  (hidden comment: 0603 10kOhm 1%)
R16  Resistance: 10Ohm  [RES_0603]  (hidden comment: 0603 10Ohm 1%)
R17  Resistance: 10kOhm  [RES_0603]  (hidden comment: 0603 10kOhm 1%)
R18  Resistance: 10Ohm  [RES_0603]  (hidden comment: 0603 10Ohm 1%)
R19  Resistance: 10kOhm  [RES_0603]  (hidden comment: 0603 10kOhm 1%)
R20  Resistance: 10Ohm  [RES_0603]  (hidden comment: 0603 10Ohm 1%)
SW1  SWITCH SMD  [B3FS-1010]  (value not drawn)
SW2  SWITCH SMD  [B3FS-1010]  (value not drawn)
SW3  SWITCH SMD  [B3FS-1010]  (value not drawn)
SW4  SWITCH SMD  [B3FS-1010]  (value not drawn)

### Ports
BUTTON_1 (out, see Top[3D]), BUTTON_2 (out, see Top[3D]), BUTTON_3 (out, see Top[3D]), BUTTON_4 (out, see Top[3D])

### Nets
GND: C7.2 C8.2 C9.2 C10.2 SW1.1 SW1.2 SW2.1 SW2.2 SW3.1 SW3.2 SW4.1 SW4.2
VCC_3V3: R13.1 R15.1 R17.1 R19.1
BUTTON_1: C7.1 R13.2 R14.2 ; port BUTTON_1
BUTTON_2: C8.1 R15.2 R16.2 ; port BUTTON_2
BUTTON_3: C9.1 R17.2 R18.2 ; port BUTTON_3
BUTTON_4: C10.1 R19.2 R20.2 ; port BUTTON_4
NetR14_1: R14.1 SW1.3 SW1.4
NetR16_1: R16.1 SW2.3 SW2.4
NetR18_1: R18.1 SW3.3 SW3.4
NetR20_1: R20.1 SW4.3 SW4.4

### Notes on the sheet
- Author:
- Sheet:
- /
- Issue date:
- Project name:
- Revision:
- Date:
- Page name:

### Library data of the parts
C7-C10 = Capacitor SMD: as C11 on sheet in_channel; Package: 0603; Supplier 1: LCSC; Supplier Part Number 1: C282519
R13-R20 = Resistor SMD_1: Generic Resistor SMD; Supplier 1: LCSC
  R13 R15 R17 R19: Manufacturer Part Number: 0603 10kOhm 1%; Supplier Part Number 1: C3017715
  R14 R16 R18 R20: Manufacturer Part Number: 0603 10Ohm 1%; Supplier Part Number 1: C22859
SW1-SW4 = B3FS-1010: SMD SWITCH B3FS-1010; Wartość: B3FS-1010; Supplier 1: LCSC; Supplier Part Number 1: C231324

## Nets that join several sheets
GND: Channel_1 (Q1_Channel_1.S Q2_Channel_1.2 R2_Channel_1.2), Channel_2 (Q1_Channel_2.S Q2_Channel_2.2 R2_Channel_2.2), Channel_3 (Q1_Channel_3.S Q2_Channel_3.2 R2_Channel_3.2), Channel_4 (Q1_Channel_4.S Q2_Channel_4.2 R2_Channel_4.2), Channel_5 (Q1_Channel_5.S Q2_Channel_5.2 R2_Channel_5.2), Channel_6 (Q1_Channel_6.S Q2_Channel_6.2 R2_Channel_6.2), Channel_7 (Q1_Channel_7.S Q2_Channel_7.2 R2_Channel_7.2), Channel_8 (Q1_Channel_8.S Q2_Channel_8.2 R2_Channel_8.2), Channel_9 (Q1_Channel_9.S Q2_Channel_9.2 R2_Channel_9.2), Channel_10 (Q1_Channel_10.S Q2_Channel_10.2 R2_Channel_10.2), Channel_11 (Q1_Channel_11.S Q2_Channel_11.2 R2_Channel_11.2), Channel_12 (Q1_Channel_12.S Q2_Channel_12.2 R2_Channel_12.2), Channel_13 (Q1_Channel_13.S Q2_Channel_13.2 R2_Channel_13.2), Channel_14 (Q1_Channel_14.S Q2_Channel_14.2 R2_Channel_14.2), Channel_15 (Q1_Channel_15.S Q2_Channel_15.2 R2_Channel_15.2), Channel_16 (Q1_Channel_16.S Q2_Channel_16.2 R2_Channel_16.2), Channel_17 (Q1_Channel_17.S Q2_Channel_17.2 R2_Channel_17.2), Channel_18 (Q1_Channel_18.S Q2_Channel_18.2 R2_Channel_18.2), Channel_19 (Q1_Channel_19.S Q2_Channel_19.2 R2_Channel_19.2), Channel_20 (Q1_Channel_20.S Q2_Channel_20.2 R2_Channel_20.2), Channel_21 (Q1_Channel_21.S Q2_Channel_21.2 R2_Channel_21.2), Channel_22 (Q1_Channel_22.S Q2_Channel_22.2 R2_Channel_22.2), Channel_23 (Q1_Channel_23.S Q2_Channel_23.2 R2_Channel_23.2), Channel_24 (Q1_Channel_24.S Q2_Channel_24.2 R2_Channel_24.2), IN_1 (7 pins), IN_2 (7 pins), IN_3 (7 pins), IN_4 (7 pins), microcontroller (12 pins), i2c_devices (9 pins), power (11 pins), others (12 pins)
SW_VCC: IN_1 (IN1_IN_1.1), IN_2 (IN1_IN_2.1), IN_3 (IN1_IN_3.1), IN_4 (IN1_IN_4.1), power (P3.2)
VCC_3V3: Channel_1 (D1_Channel_1.A), Channel_2 (D1_Channel_2.A), Channel_3 (D1_Channel_3.A), Channel_4 (D1_Channel_4.A), Channel_5 (D1_Channel_5.A), Channel_6 (D1_Channel_6.A), Channel_7 (D1_Channel_7.A), Channel_8 (D1_Channel_8.A), Channel_9 (D1_Channel_9.A), Channel_10 (D1_Channel_10.A), Channel_11 (D1_Channel_11.A), Channel_12 (D1_Channel_12.A), Channel_13 (D1_Channel_13.A), Channel_14 (D1_Channel_14.A), Channel_15 (D1_Channel_15.A), Channel_16 (D1_Channel_16.A), Channel_17 (D1_Channel_17.A), Channel_18 (D1_Channel_18.A), Channel_19 (D1_Channel_19.A), Channel_20 (D1_Channel_20.A), Channel_21 (D1_Channel_21.A), Channel_22 (D1_Channel_22.A), Channel_23 (D1_Channel_23.A), Channel_24 (D1_Channel_24.A), IN_1 (D7_IN_1.A R21_IN_1.1), IN_2 (D7_IN_2.A R21_IN_2.1), IN_3 (D7_IN_3.A R21_IN_3.1), IN_4 (D7_IN_4.A R21_IN_4.1), microcontroller (D2.A R5.1 R6.1), i2c_devices (6 pins), power (6 pins), others (R13.1 R15.1 R17.1 R19.1)
VIN_LED: Channel_1 (P1_Channel_1.1), Channel_2 (P1_Channel_2.1), Channel_3 (P1_Channel_3.1), Channel_4 (P1_Channel_4.1), Channel_5 (P1_Channel_5.1), Channel_6 (P1_Channel_6.1), Channel_7 (P1_Channel_7.1), Channel_8 (P1_Channel_8.1), Channel_9 (P1_Channel_9.1), Channel_10 (P1_Channel_10.1), Channel_11 (P1_Channel_11.1), Channel_12 (P1_Channel_12.1), Channel_13 (P1_Channel_13.1), Channel_14 (P1_Channel_14.1), Channel_15 (P1_Channel_15.1), Channel_16 (P1_Channel_16.1), Channel_17 (P1_Channel_17.1), Channel_18 (P1_Channel_18.1), Channel_19 (P1_Channel_19.1), Channel_20 (P1_Channel_20.1), Channel_21 (P1_Channel_21.1), Channel_22 (P1_Channel_22.1), Channel_23 (P1_Channel_23.1), Channel_24 (P1_Channel_24.1), power (5 pins)
BUTTON_1: i2c_devices (U2.7), others (C7.1 R13.2 R14.2)
BUTTON_2: i2c_devices (U2.6), others (C8.1 R15.2 R16.2)
BUTTON_3: i2c_devices (U2.11), others (C9.1 R17.2 R18.2)
BUTTON_4: i2c_devices (U2.10), others (C10.1 R19.2 R20.2)
GP0: Channel_1 (R1_Channel_1.2 R2_Channel_1.1 R3_Channel_1.2), microcontroller (U1.1)
GP1: Channel_2 (R1_Channel_2.2 R2_Channel_2.1 R3_Channel_2.2), microcontroller (U1.2)
GP2: Channel_24 (R1_Channel_24.2 R2_Channel_24.1 R3_Channel_24.2), microcontroller (U1.4)
GP3: Channel_23 (R1_Channel_23.2 R2_Channel_23.1 R3_Channel_23.2), microcontroller (U1.5)
GP4: Channel_3 (R1_Channel_3.2 R2_Channel_3.1 R3_Channel_3.2), microcontroller (U1.6)
GP5: Channel_4 (R1_Channel_4.2 R2_Channel_4.1 R3_Channel_4.2), microcontroller (U1.7)
GP6: Channel_22 (R1_Channel_22.2 R2_Channel_22.1 R3_Channel_22.2), microcontroller (U1.9)
GP7: Channel_21 (R1_Channel_21.2 R2_Channel_21.1 R3_Channel_21.2), microcontroller (U1.10)
GP8: Channel_20 (R1_Channel_20.2 R2_Channel_20.1 R3_Channel_20.2), microcontroller (U1.11)
GP9: Channel_19 (R1_Channel_19.2 R2_Channel_19.1 R3_Channel_19.2), microcontroller (U1.12)
GP10: Channel_18 (R1_Channel_18.2 R2_Channel_18.1 R3_Channel_18.2), microcontroller (U1.14)
GP11: Channel_17 (R1_Channel_17.2 R2_Channel_17.1 R3_Channel_17.2), microcontroller (U1.15)
GP12: Channel_16 (R1_Channel_16.2 R2_Channel_16.1 R3_Channel_16.2), microcontroller (U1.16)
GP13: Channel_15 (R1_Channel_15.2 R2_Channel_15.1 R3_Channel_15.2), microcontroller (U1.17)
GP14: Channel_14 (R1_Channel_14.2 R2_Channel_14.1 R3_Channel_14.2), microcontroller (U1.19)
GP15: Channel_13 (R1_Channel_13.2 R2_Channel_13.1 R3_Channel_13.2), microcontroller (U1.20)
GP16: Channel_12 (R1_Channel_12.2 R2_Channel_12.1 R3_Channel_12.2), microcontroller (U1.21)
GP17: Channel_11 (R1_Channel_11.2 R2_Channel_11.1 R3_Channel_11.2), microcontroller (U1.22)
GP18: Channel_10 (R1_Channel_10.2 R2_Channel_10.1 R3_Channel_10.2), microcontroller (U1.24)
GP19: Channel_9 (R1_Channel_9.2 R2_Channel_9.1 R3_Channel_9.2), microcontroller (U1.25)
GP22: Channel_8 (R1_Channel_8.2 R2_Channel_8.1 R3_Channel_8.2), microcontroller (U1.29)
GP26: Channel_7 (R1_Channel_7.2 R2_Channel_7.1 R3_Channel_7.2), microcontroller (U1.31)
GP27: Channel_6 (R1_Channel_6.2 R2_Channel_6.1 R3_Channel_6.2), microcontroller (U1.32)
GP28: Channel_5 (R1_Channel_5.2 R2_Channel_5.1 R3_Channel_5.2), microcontroller (U1.34)
I2C_SCL: microcontroller (R6.2 U1.27), i2c_devices (OLED1.3 U2.1)
I2C_SDA: microcontroller (R5.2 U1.26), i2c_devices (OLED1.4 U2.2)
PIR_HIGH_OUT: IN_1 (7 pins), i2c_devices (U2.9)
PIR_LOW_OUT: IN_2 (7 pins), i2c_devices (U2.12)
SWITCH_1: IN_3 (7 pins), i2c_devices (U2.14)
SWITCH_2: IN_4 (7 pins), i2c_devices (U2.13)